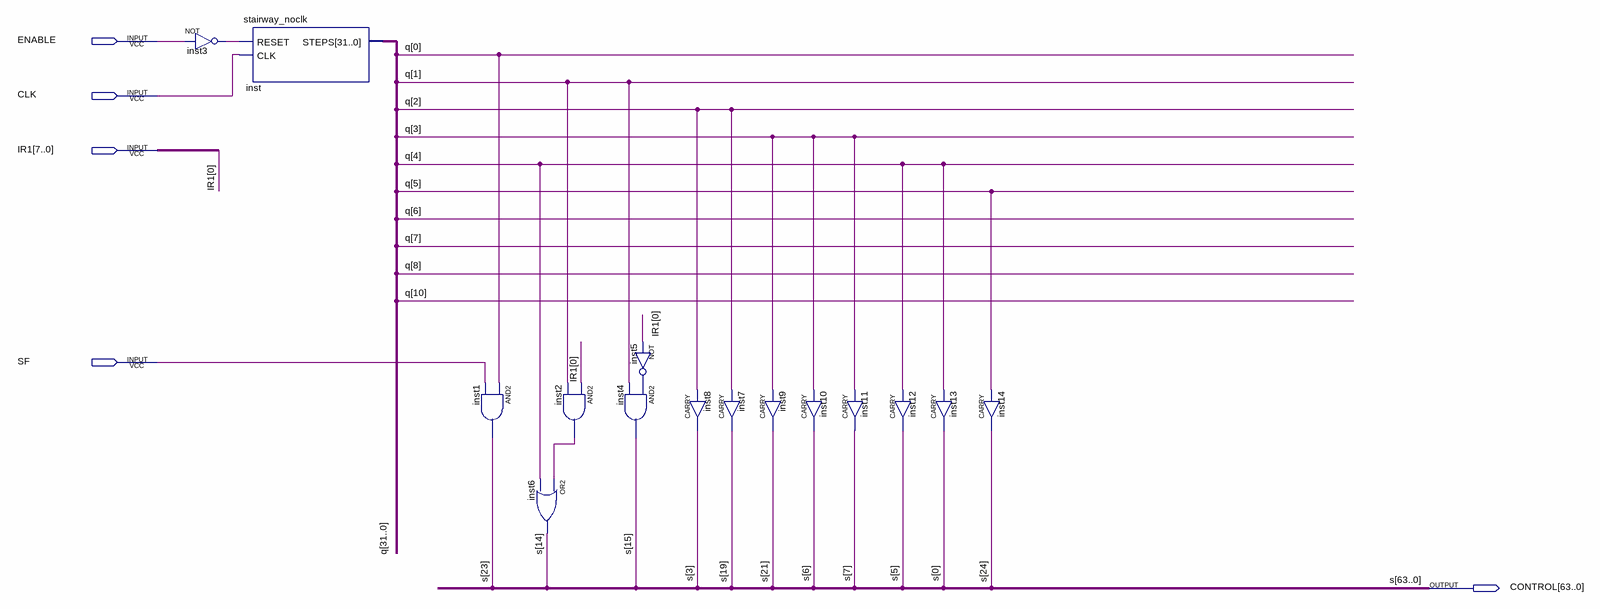
[diagram p0: schematic sheet]
// Quartus schematic macro_js.bdf as structural Verilog: 15 symbols, 5 pins
module macro_js (
  input  ENABLE,
  input  CLK,
  input  [7:0] IR1,
  input  SF,
  output [63:0] CONTROL
);

  wire inst2_out, inst3_out, inst5_out;
  wire [31:0] q;

  not inst3 (inst3_out, ENABLE);
  stairway_noclk inst (.RESET(inst3_out), .CLK(CLK), .STEPS(q));
  and inst1 (CONTROL[23], q[0], SF);
  and inst2 (inst2_out, IR1[0], q[1]);
  or inst6 (CONTROL[14], inst2_out, q[4]);
  not inst5 (inst5_out, IR1[0]);
  and inst4 (CONTROL[15], inst5_out, q[1]);
  CARRY inst8 (.IN(q[2]), .OUT(CONTROL[3]));
  CARRY inst7 (.IN(q[2]), .OUT(CONTROL[19]));
  CARRY inst9 (.IN(q[3]), .OUT(CONTROL[21]));
  CARRY inst10 (.IN(q[3]), .OUT(CONTROL[6]));
  CARRY inst11 (.IN(q[3]), .OUT(CONTROL[7]));
  CARRY inst12 (.IN(q[4]), .OUT(CONTROL[5]));
  CARRY inst13 (.IN(q[4]), .OUT(CONTROL[0]));
  CARRY inst14 (.IN(q[5]), .OUT(CONTROL[24]));

  // Other names for the same wires on the sheet: s[63:0] = CONTROL
endmodule
